# EAGLE design stm32f4-discovery_microhal (EAGLE 7.3.0)
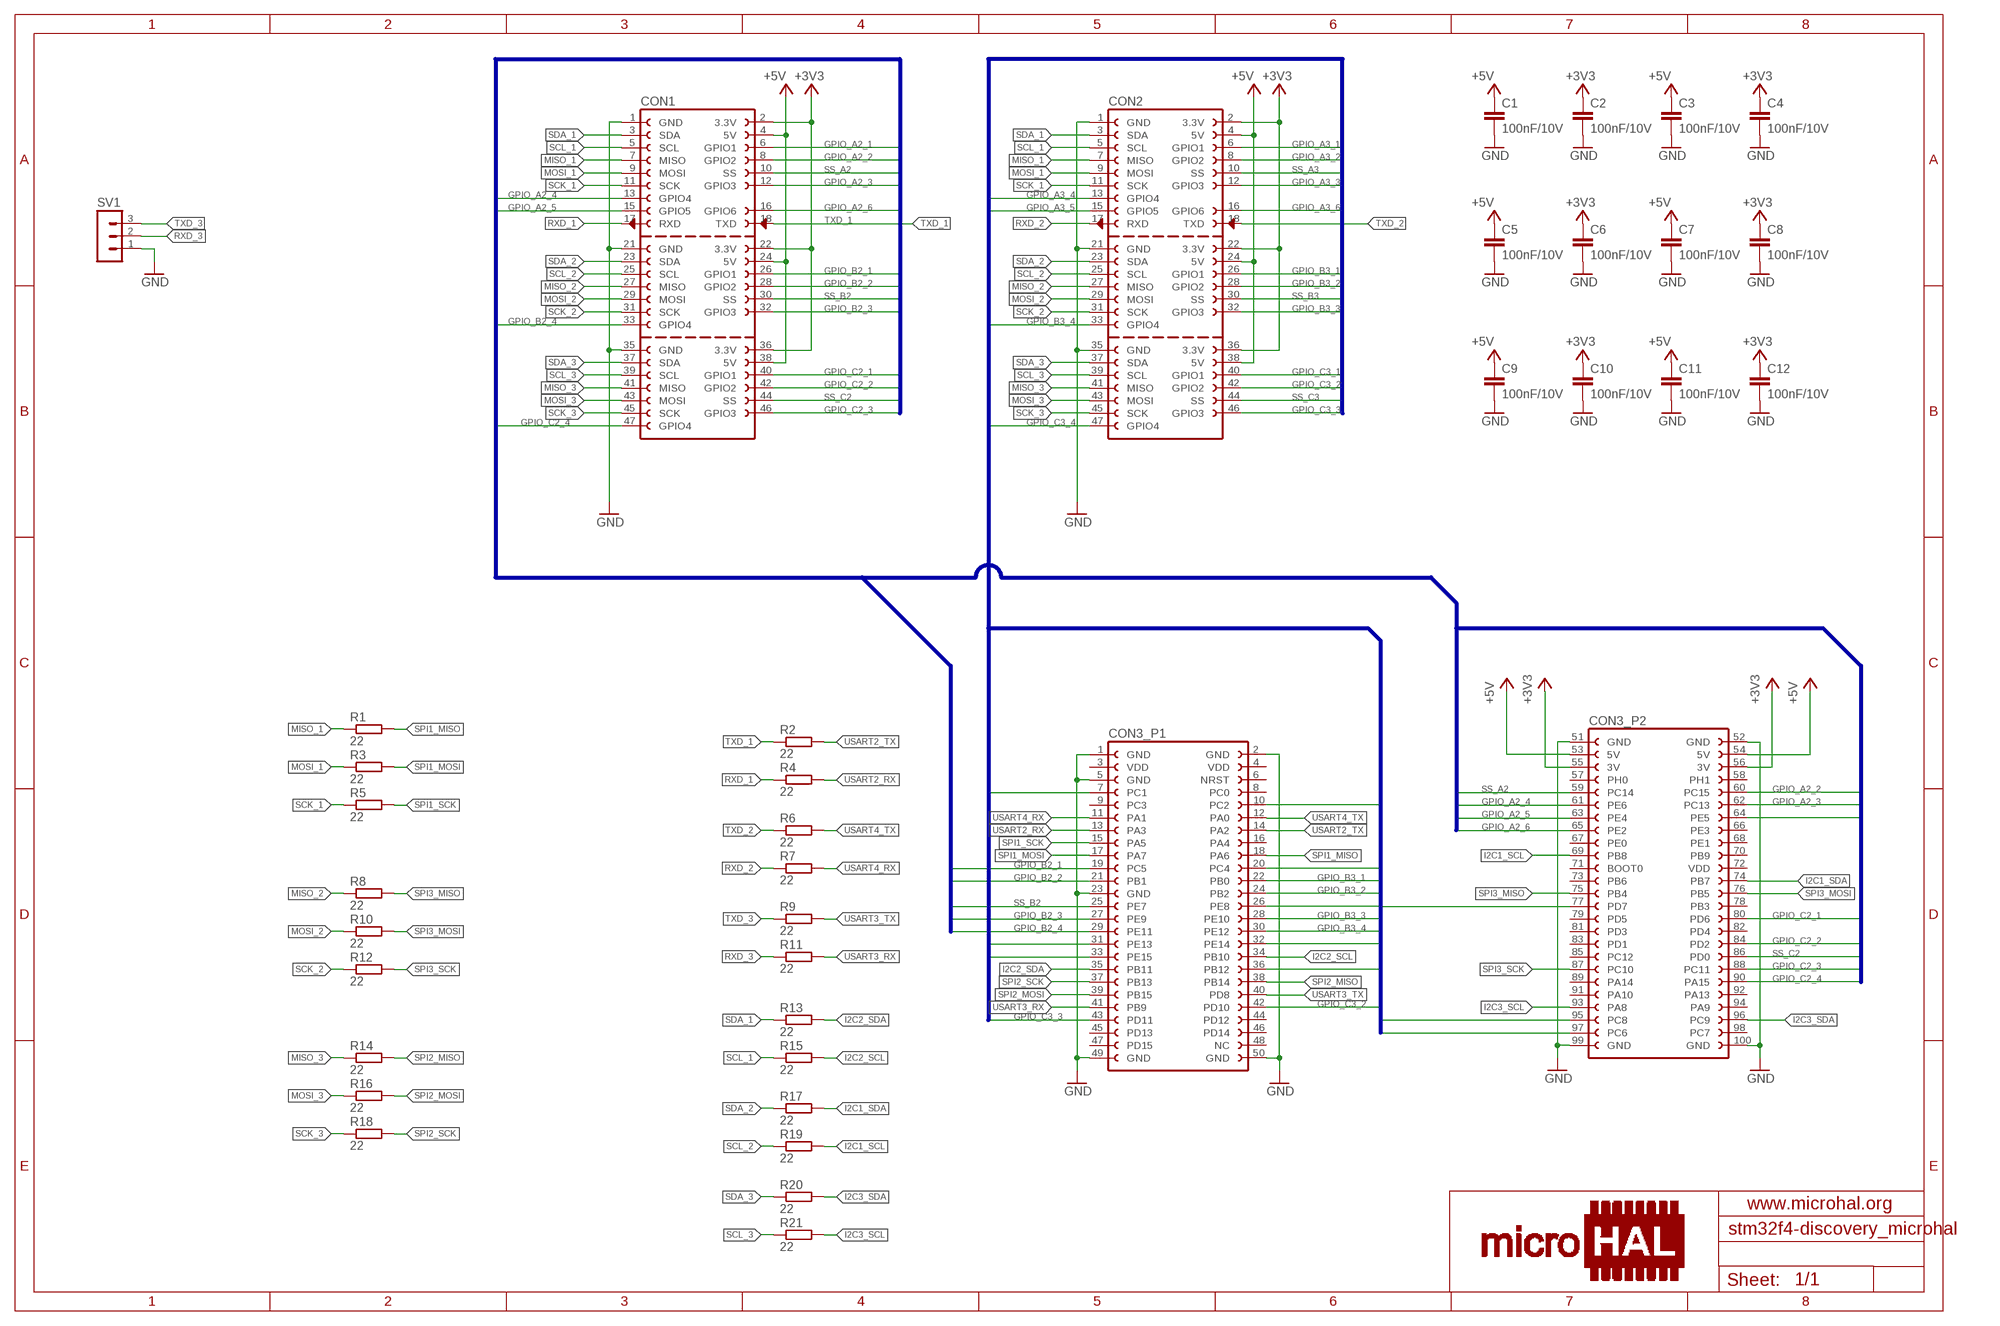
[diagram p0: schematic, sheet 1]

## Parts
C1  100nF/10V  C-EUC0603K  [C0603K]
C2  100nF/10V  C-EUC0603K  [C0603K]
C3  100nF/10V  C-EUC0603K  [C0603K]
C4  100nF/10V  C-EUC0603K  [C0603K]
C5  100nF/10V  C-EUC0603K  [C0603K]
C6  100nF/10V  C-EUC0603K  [C0603K]
C7  100nF/10V  C-EUC0603K  [C0603K]
C8  100nF/10V  C-EUC0603K  [C0603K]
C9  100nF/10V  C-EUC0603K  [C0603K]
C10  100nF/10V  C-EUC0603K  [C0603K]
C11  100nF/10V  C-EUC0603K  [C0603K]
C12  100nF/10V  C-EUC0603K  [C0603K]
CON1  MICROHAL_CONNECTOR_F_3  [MICROHAL_CONNECTOR_F_3]
CON2  MICROHAL_CONNECTOR_F_3  [MICROHAL_CONNECTOR_F_3]
CON3  STM32F4DISCOVERY-CONNECTOR  [STM32F4DISCOVERY_CONNECTOR]
R1  22  R-EU_R0603  [R0603]
R2  22  R-EU_R0603  [R0603]
R3  22  R-EU_R0603  [R0603]
R4  22  R-EU_R0603  [R0603]
R5  22  R-EU_R0603  [R0603]
R6  22  R-EU_R0603  [R0603]
R7  22  R-EU_R0603  [R0603]
R8  22  R-EU_R0603  [R0603]
R9  22  R-EU_R0603  [R0603]
R10  22  R-EU_R0603  [R0603]
R11  22  R-EU_R0603  [R0603]
R12  22  R-EU_R0603  [R0603]
R13  22  R-EU_R0603  [R0603]
R14  22  R-EU_R0603  [R0603]
R15  22  R-EU_R0603  [R0603]
R16  22  R-EU_R0603  [R0603]
R17  22  R-EU_R0603  [R0603]
R18  22  R-EU_R0603  [R0603]
R19  22  R-EU_R0603  [R0603]
R20  22  R-EU_R0603  [R0603]
R21  22  R-EU_R0603  [R0603]
SV1  MA03-1  [MA03-1]

## Nets
+3V3: C2.1 C4.1 C6.1 C8.1 C10.1 C12.1 CON1.2(3.3V) CON1.22(3.3V) CON1.36(3.3V) CON2.2(3.3V) CON2.22(3.3V) CON2.36(3.3V) CON3.55(_P2:3V) CON3.56(_P2:3V)
+5V: C1.1 C3.1 C5.1 C7.1 C9.1 C11.1 CON1.4(5V) CON1.24(5V) CON1.38(5V) CON2.4(5V) CON2.24(5V) CON2.38(5V) CON3.53(_P2:5V) CON3.54(_P2:5V)
GND: C1.2 C2.2 C3.2 C4.2 C5.2 C6.2 C7.2 C8.2 C9.2 C10.2 C11.2 C12.2 CON1.1(GND) CON1.21(GND) CON1.35(GND) CON2.1(GND) CON2.21(GND) CON2.35(GND) CON3.1(_P1:GND) CON3.2(_P1:GND) CON3.5(_P1:GND) CON3.23(_P1:GND) CON3.49(_P1:GND) CON3.50(_P1:GND) CON3.51(_P2:GND) CON3.52(_P2:GND) CON3.99(_P2:GND) CON3.100(_P2:GND) SV1.1
GPIO_A2_1: CON1.6(GPIO1) CON3.64(_P2:PE5)
GPIO_A2_2: CON1.8(GPIO2) CON3.60(_P2:PC15)
GPIO_A2_3: CON1.12(GPIO3) CON3.62(_P2:PC13)
GPIO_A2_4: CON1.13(GPIO4) CON3.61(_P2:PE6)
GPIO_A2_5: CON1.15(GPIO5) CON3.63(_P2:PE4)
GPIO_A2_6: CON1.16(GPIO6) CON3.65(_P2:PE2)
GPIO_A3_1: CON2.6(GPIO1) CON3.97(_P2:PC6)
GPIO_A3_2: CON2.8(GPIO2) CON3.31(_P1:PE13)
GPIO_A3_3: CON2.12(GPIO3) CON3.7(_P1:PC1)
GPIO_A3_4: CON2.13(GPIO4) CON3.10(_P1:PC2)
GPIO_A3_5: CON2.15(GPIO5) CON3.20(_P1:PC4)
GPIO_A3_6: CON2.16(GPIO6) CON3.77(_P2:PD7)
GPIO_B2_1: CON1.26(GPIO1) CON3.19(_P1:PC5)
GPIO_B2_2: CON1.28(GPIO2) CON3.21(_P1:PB1)
GPIO_B2_3: CON1.32(GPIO3) CON3.27(_P1:PE9)
GPIO_B2_4: CON1.33(GPIO4) CON3.29(_P1:PE11)
GPIO_B3_1: CON2.26(GPIO1) CON3.22(_P1:PB0)
GPIO_B3_2: CON2.28(GPIO2) CON3.24(_P1:PB2)
GPIO_B3_3: CON2.32(GPIO3) CON3.28(_P1:PE10)
GPIO_B3_4: CON2.33(GPIO4) CON3.30(_P1:PE12)
GPIO_C2_1: CON1.40(GPIO1) CON3.80(_P2:PD6)
GPIO_C2_2: CON1.42(GPIO2) CON3.84(_P2:PD2)
GPIO_C2_3: CON1.46(GPIO3) CON3.88(_P2:PC11)
GPIO_C2_4: CON1.47(GPIO4) CON3.90(_P2:PA15)
GPIO_C3_1: CON2.40(GPIO1) CON3.32(_P1:PE14)
GPIO_C3_2: CON2.42(GPIO2) CON3.42(_P1:PD10)
GPIO_C3_3: CON2.46(GPIO3) CON3.43(_P1:PD11)
GPIO_C3_4: CON2.47(GPIO4) CON3.95(_P2:PC8)
I2C1_SCL: CON3.69(_P2:PB8) R19.2
I2C1_SDA: CON3.74(_P2:PB7) R17.2
I2C2_SCL: CON3.34(_P1:PB10) R15.2
I2C2_SDA: CON3.35(_P1:PB11) R13.2
I2C3_SCL: CON3.93(_P2:PA8) R21.2
I2C3_SDA: CON3.96(_P2:PC9) R20.2
MISO_1: CON1.7(MISO) CON2.7(MISO) R1.1
MISO_2: CON1.27(MISO) CON2.27(MISO) R8.1
MISO_3: CON1.41(MISO) CON2.41(MISO) R14.1
MOSI_1: CON1.9(MOSI) CON2.9(MOSI) R3.1
MOSI_2: CON1.29(MOSI) CON2.29(MOSI) R10.1
MOSI_3: CON1.43(MOSI) CON2.43(MOSI) R16.1
RXD_1: CON1.17(RXD) R4.1
RXD_2: CON2.17(RXD) R7.1
RXD_3: R11.1 SV1.2
SCK_1: CON1.11(SCK) CON2.11(SCK) R5.1
SCK_2: CON1.31(SCK) CON2.31(SCK) R12.1
SCK_3: CON1.45(SCK) CON2.45(SCK) R18.1
SCL_1: CON1.5(SCL) CON2.5(SCL) R15.1
SCL_2: CON1.25(SCL) CON2.25(SCL) R19.1
SCL_3: CON1.39(SCL) CON2.39(SCL) R21.1
SDA_1: CON1.3(SDA) CON2.3(SDA) R13.1
SDA_2: CON1.23(SDA) CON2.23(SDA) R17.1
SDA_3: CON1.37(SDA) CON2.37(SDA) R20.1
SPI1_MISO: CON3.18(_P1:PA6) R1.2
SPI1_MOSI: CON3.17(_P1:PA7) R3.2
SPI1_SCK: CON3.15(_P1:PA5) R5.2
SPI2_MISO: CON3.38(_P1:PB14) R14.2
SPI2_MOSI: CON3.39(_P1:PB15) R16.2
SPI2_SCK: CON3.37(_P1:PB13) R18.2
SPI3_MISO: CON3.75(_P2:PB4) R8.2
SPI3_MOSI: CON3.76(_P2:PB5) R10.2
SPI3_SCK: CON3.87(_P2:PC10) R12.2
SS_A2: CON1.10(SS) CON3.59(_P2:PC14)
SS_A3: CON2.10(SS) CON3.33(_P1:PE15)
SS_B2: CON1.30(SS) CON3.25(_P1:PE7)
SS_B3: CON2.30(SS) CON3.26(_P1:PE8)
SS_C2: CON1.44(SS) CON3.86(_P2:PD0)
SS_C3: CON2.44(SS) CON3.36(_P1:PB12)
TXD_1: CON1.18(TXD) R2.1
TXD_2: CON2.18(TXD) R6.1
TXD_3: R9.1 SV1.3
USART2_RX: CON3.13(_P1:PA3) R4.2
USART2_TX: CON3.14(_P1:PA2) R2.2
USART3_RX: CON3.41(_P1:PB9) R11.2
USART3_TX: CON3.40(_P1:PD8) R9.2
USART4_RX: CON3.11(_P1:PA1) R7.2
USART4_TX: CON3.12(_P1:PA0) R6.2
Unconnected: CON3.3(_P1:VDD) CON3.4(_P1:VDD) CON3.6(_P1:NRST) CON3.8(_P1:PC0) CON3.9(_P1:PC3) CON3.16(_P1:PA4) CON3.44(_P1:PD12) CON3.45(_P1:PD13) CON3.46(_P1:PD14) CON3.47(_P1:PD15) CON3.48(_P1:NC) CON3.57(_P2:PH0) CON3.58(_P2:PH1) CON3.66(_P2:PE3) CON3.67(_P2:PE0) CON3.68(_P2:PE1) CON3.70(_P2:PB9) CON3.71(_P2:BOOT0) CON3.72(_P2:VDD) CON3.73(_P2:PB6) CON3.78(_P2:PB3) CON3.79(_P2:PD5) CON3.81(_P2:PD3) CON3.82(_P2:PD4) CON3.83(_P2:PD1) CON3.85(_P2:PC12) CON3.89(_P2:PA14) CON3.91(_P2:PA10) CON3.92(_P2:PA13) CON3.94(_P2:PA9) CON3.98(_P2:PC7)

## Buses
GPIO_A2_[1..6],GPIO_B2_[1..4],GPIO_C2_[1..4],SS_A2,SS_B2,SS_C2
GPIO_A3_[1..6],GPIO_B3_[1..4],GPIO_C3_[1..4],SS_A3,SS_B3,SS_C3

## Library data of the parts
C1-C12 = rcl:C-EU: CAPACITOR, European symbol
CON1 CON2 = microhal-connector_v0.1:MICROHAL_CONNECTOR_F_3: Connector used in microhal development board.
CON3 = stm32f4Discovery_connector:STM32F4DISCOVERY-CONNECTOR
R1-R21 = rcl:R-EU_: RESISTOR, European symbol
SV1 = con-lstb:MA03-1: PIN HEADER; OC_FARNELL: unknown; OC_NEWARK: unknown

## Board
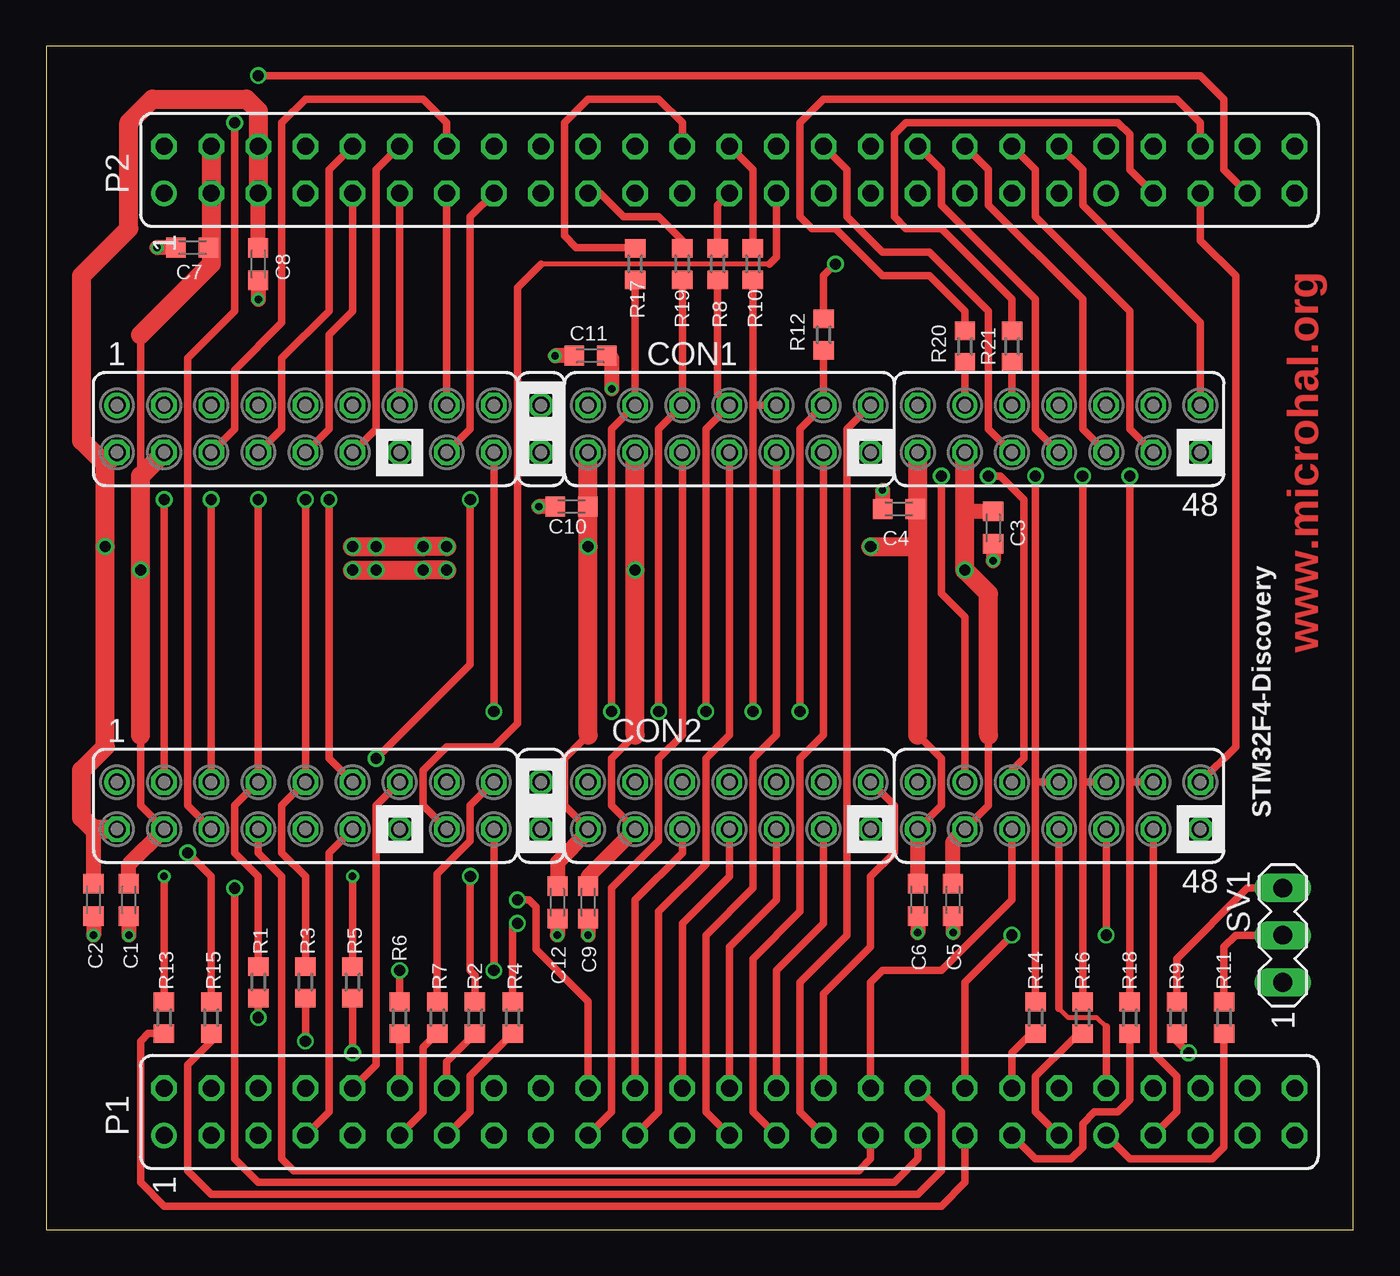
[diagram p1: board, top side]
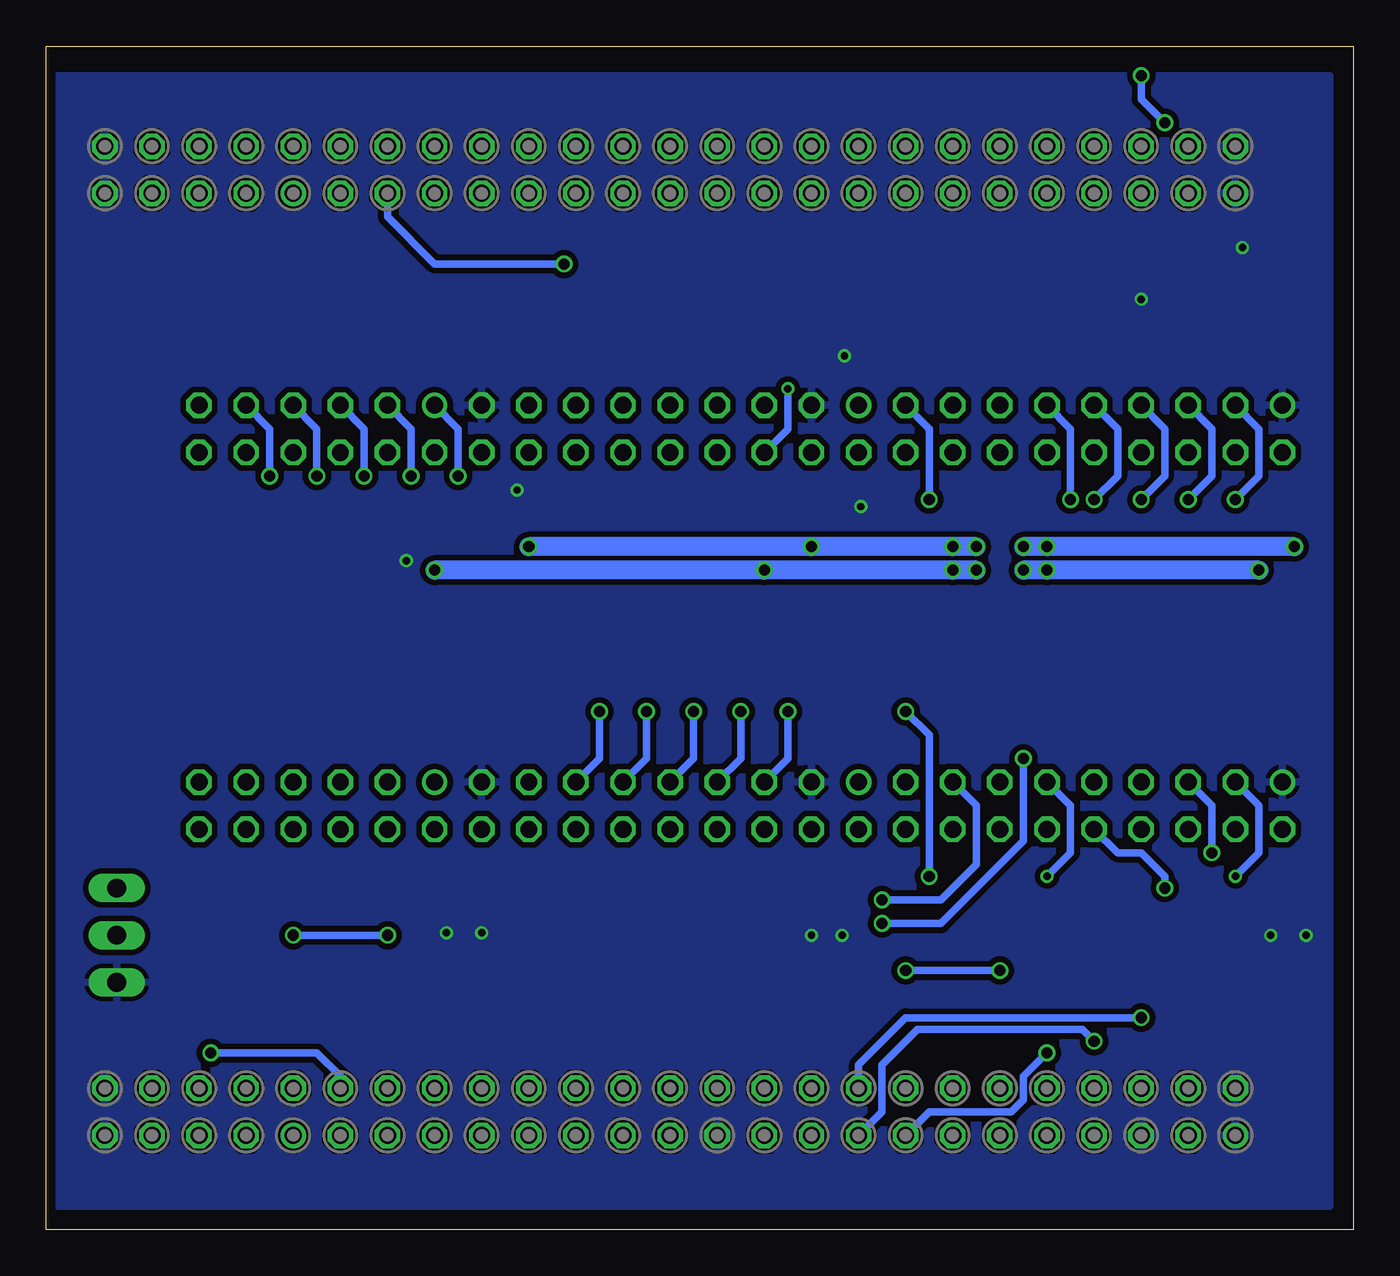
[diagram p2: board, bottom side, seen from below]

Size 70.47 x 63.8 mm. Coordinates in mm from the lower left corner, seen from the top.
Outline: 0,0 70.47,0 70.47,63.8 0,63.8 0,0
Copper layers (1*16): Top 0.035mm / dielectric 1.6mm / Bottom 0.035mm
Design rules "Elecrow_2-layer_PCB_eagle_rule": minimum track width 6mil, minimum drill 12mil, track to track 6mil, track to pad 6mil, pad to pad 6mil, via to via 8mil, smd to smd 0mil, copper to edge 20mil, drill to drill 10mil, minimum pad ring 6mil, minimum via ring 6mil, stop-mask expansion 0mil, vias tented up to drill 100mil, thermal gap 10mil

### Footprints (pad centres in the part's own frame; a part is rotated, then mirrored left to right if it is on the bottom)
C0603K = smd 1.05 x 1.08: 1 -0.875,0; 2 0.875,0
MICROHAL_CONNECTOR_F_3 = drill 0.914: 1 -33.02,1.27; 19 -10.16,1.27; 37 12.7,1.27 | drill 0.914 octagon: 2 -33.02,-1.27; 3 -30.48,1.27; 4 -30.48,-1.27; 5 -27.94,1.27; 6 -27.94,-1.27; 7 -25.4,1.27; 8 -25.4,-1.27; 9 -22.86,1.27; 10 -22.86,-1.27; 11 -20.32,1.27; 12 -20.32,-1.27; 13 -17.78,1.27; 14 -17.78,-1.27; 15 -15.24,1.27; 16 -15.24,-1.27; 17 -12.7,1.27; 18 -12.7,-1.27; 20 -10.16,-1.27; 21 -7.62,1.27; 22 -7.62,-1.27; 23 -5.08,1.27; 24 -5.08,-1.27; 25 -2.54,1.27; 26 -2.54,-1.27; 27 0,1.27; 28 0,-1.27; 29 2.54,1.27; 30 2.54,-1.27; 31 5.08,1.27; 32 5.08,-1.27; 33 7.62,1.27; 34 7.62,-1.27; 35 10.16,1.27; 36 10.16,-1.27; 38 12.7,-1.27; 39 15.24,1.27; 40 15.24,-1.27; 41 17.78,1.27; 42 17.78,-1.27; 43 20.32,1.27; 44 20.32,-1.27; 45 22.86,1.27; 46 22.86,-1.27; 47 25.4,1.27; 48 25.4,-1.27
STM32F4DISCOVERY_CONNECTOR = drill 0.914: 1 -1.27,30.48; 41 -1.27,-20.32; 51 49.53,30.48; 91 49.53,-20.32 | drill 0.914 octagon: 2 1.27,30.48; 3 -1.27,27.94; 4 1.27,27.94; 5 -1.27,25.4; 6 1.27,25.4; 7 -1.27,22.86; 8 1.27,22.86; 9 -1.27,20.32; 10 1.27,20.32; 11 -1.27,17.78; 12 1.27,17.78; 13 -1.27,15.24; 14 1.27,15.24; 15 -1.27,12.7; 16 1.27,12.7; 17 -1.27,10.16; 18 1.27,10.16; 19 -1.27,7.62; 20 1.27,7.62; 21 -1.27,5.08; 22 1.27,5.08; 23 -1.27,2.54; 24 1.27,2.54; 25 -1.27,0; 26 1.27,0; 27 -1.27,-2.54; 28 1.27,-2.54; 29 -1.27,-5.08; 30 1.27,-5.08; 31 -1.27,-7.62; 32 1.27,-7.62; 33 -1.27,-10.16; 34 1.27,-10.16; 35 -1.27,-12.7; 36 1.27,-12.7; 37 -1.27,-15.24; 38 1.27,-15.24; 39 -1.27,-17.78; 40 1.27,-17.78; 42 1.27,-20.32; 43 -1.27,-22.86; 44 1.27,-22.86; 45 -1.27,-25.4; 46 1.27,-25.4; 47 -1.27,-27.94; 48 1.27,-27.94; 49 -1.27,-30.48; 50 1.27,-30.48; 52 52.07,30.48; 53 49.53,27.94; 54 52.07,27.94; 55 49.53,25.4; 56 52.07,25.4; 57 49.53,22.86; 58 52.07,22.86; 59 49.53,20.32; 60 52.07,20.32; 61 49.53,17.78; 62 52.07,17.78; 63 49.53,15.24; 64 52.07,15.24; 65 49.53,12.7; 66 52.07,12.7; 67 49.53,10.16; 68 52.07,10.16; 69 49.53,7.62; 70 52.07,7.62; 71 49.53,5.08; 72 52.07,5.08; 73 49.53,2.54; 74 52.07,2.54; 75 49.53,0; 76 52.07,0; 77 49.53,-2.54; 78 52.07,-2.54; 79 49.53,-5.08; 80 52.07,-5.08; 81 49.53,-7.62; 82 52.07,-7.62; 83 49.53,-10.16; 84 52.07,-10.16; 85 49.53,-12.7; 86 52.07,-12.7; 87 49.53,-15.24; 88 52.07,-15.24; 89 49.53,-17.78; 90 52.07,-17.78; 92 52.07,-20.32; 93 49.53,-22.86; 94 52.07,-22.86; 95 49.53,-25.4; 96 52.07,-25.4; 97 49.53,-27.94; 98 52.07,-27.94; 99 49.53,-30.48; 100 52.07,-30.48
R0603 = smd 1 x 1.1: 1 -0.85,0; 2 0.85,0
MA03-1 = drill 1.016 long: 1 -2.54,0; 2 0,0; 3 2.54,0

### Placement (x,y rotation side)
C1  4.45,17.78 270 top
C2  2.54,17.78 270 top
C3  51.05,37.85 270 top
C4  45.97,38.86 180 top
C5  48.9,17.78 270 top
C6  46.99,17.78 270 top
C7  7.87,52.96 180 top
C8  11.43,52.07 270 top
C9  29.21,17.65 270 top
C10  28.32,38.99 180 top
C11  29.34,47.12 180 top
C12  27.56,17.65 270 top
CON1  36.83,43.18 0 top
CON2  36.83,22.86 0 top
CON3  36.83,6.35 90 top
R1  11.43,13.34 270 top
R2  23.11,11.43 270 top
R3  13.97,13.34 270 top
R4  25.15,11.43 270 top
R5  16.51,13.34 270 top
R6  19.05,11.43 270 top
R7  21.08,11.43 270 top
R8  36.2,52.07 90 top
R9  60.96,11.43 270 top
R10  38.1,52.07 90 top
R11  63.5,11.43 270 top
R12  41.91,48.26 90 top
R13  6.35,11.43 270 top
R14  53.34,11.43 270 top
R15  8.89,11.43 270 top
R16  55.88,11.43 270 top
R17  31.75,52.07 90 top
R18  58.42,11.43 270 top
R19  34.29,52.07 90 top
R20  49.53,47.62 90 top
R21  52.07,47.62 90 top
SV1  66.67,15.88 90 top

### Tracks (layer width: path | path; a pad name or v marks a point on that pad's centre or on a via)
+3V3  (via drill 0.6)
  Top 0.406: CON2.36 48.26,22.86 48.26,25.4 46.99,26.67 | CON2.22 27.94,22.86 27.94,25.4 29.21,26.67
  Top 0.813: C2.1 2.54,21.59 | C4.1 46.86,38.86 46.99,38.73 | C6.1 CON2.36 | C8.1 CON3.55 | C10.1 29.2,39.36 29.21,39.37 | CON2.22 29.21,21.46 27.56,19.81 C12.1
  Top 1.016: CON2.2 2.54,21.59 1.91,22.23 1.91,24.77 3.17,26.04 v3.17,36.83 3.17,41.27 | 3.17,41.27 CON1.2 | 46.99,26.67 46.99,36.83 | 46.99,36.83 46.99,38.73 CON1.36 | 29.21,26.67 v29.21,36.83 29.21,39.37 CON1.22 | v44.45,36.83 46.99,36.83 | v16.51,36.83 v17.78,36.83 v20.32,36.83 v21.59,36.83 | CON3.55 CON3.56 11.43,60.33 10.79,60.96 5.71,60.96 4.45,59.69 4.45,53.98 1.91,51.44 1.91,42.55 3.17,41.27
  Bottom 1.016: v3.17,36.83 v16.51,36.83 v17.78,36.83 | v20.32,36.83 v21.59,36.83 v29.21,36.83 v44.45,36.83
+5V  (via drill 0.4, 0.6)
  Top 0.406: CON2.4 5.08,22.86 5.08,26.67 | CON2.38 50.8,22.86 50.8,26.67 | CON2.24 30.48,22.86 30.48,25.4 31.75,26.67 | 5.08,48.26 5.08,40.64
  Top 0.813: C1.1 4.45,19.68 CON2.4 | C3.1 49.54,38.72 49.53,38.73 | C5.1 48.9,20.95 CON2.38 | C7.1 8.75,53.2 8.89,53.34 | CON2.24 29.21,19.05 C9.1 | C11.1 30.35,47.12 30.48,46.99 v30.48,45.34
  Top 1.016: 5.08,26.67 v5.08,35.56 5.08,40.64 CON1.4 | 50.8,26.67 50.8,34.29 v49.53,35.56 49.53,38.73 CON1.38 | 31.75,26.67 v31.75,35.56 CON1.24 | CON3.54 CON3.53 8.89,53.34 8.89,52.07 5.08,48.26 | v21.59,35.56 v20.32,35.56 v17.78,35.56 v16.51,35.56
  Bottom 0.406: v30.48,45.34 30.48,43.18 CON1.24
  Bottom 1.016: v5.08,35.56 v16.51,35.56 v17.78,35.56 | v20.32,35.56 v21.59,35.56 v31.75,35.56 v49.53,35.56
GND  (via drill 0.4)
  Top 0.813: C2.2 v2.54,15.88 | C1.2 v4.45,15.88 | C4.2 45.1,39.86 v45.09,39.88 | C3.2 v51.05,36.07 | C6.2 v46.99,16 | C5.2 v48.9,16 | C7.2 v5.97,52.96 | C8.2 v11.43,50.16 | C9.2 v29.21,15.88 | C10.2 v26.54,38.99 | C12.2 v27.56,15.88 | C11.2 v27.43,47.12
  pour Bottom (isolate 0.305): 1.27,62.23 69.85,62.23 69.85,1.27 1.27,1.27
GPIO_A2_1
  Top 0.406: CON1.6 10.16,43.18 10.16,46.35 12.7,48.9 12.7,59.69 13.97,60.96 20.32,60.96 21.59,59.69 CON3.64
GPIO_A2_2
  Top 0.406: CON3.60 15.24,57.15 15.24,49.53 12.7,46.99 12.7,43.18 CON1.8
GPIO_A2_3
  Top 0.406: CON3.62 17.78,57.15 17.78,43.18 CON1.12
GPIO_A2_4
  Top 0.406: CON1.13 CON3.61
GPIO_A2_5
  Top 0.406: CON1.15 CON3.63
GPIO_A2_6
  Top 0.406: CON3.65 22.86,54.61 22.86,43.18 CON1.16
GPIO_A3_1  (via drill 0.6)
  Top 0.406: CON3.97 63.5,57.15 63.5,60.96 62.23,62.23 v11.43,62.23 | v10.16,59.69 10.16,49.53 7.62,46.99 7.62,22.86 CON2.6
  Bottom 0.406: v11.43,62.23 11.43,60.96 v10.16,59.69
GPIO_A3_2
  Top 0.406: CON2.8 11.43,20.32 12.7,19.05 12.7,3.81 13.34,3.17 43.81,3.17 44.45,3.81 CON3.31
GPIO_A3_3
  Top 0.406: CON3.7 15.24,6.35 15.24,20.32 CON2.12
GPIO_A3_4
  Top 0.406: CON3.10 17.78,8.89 17.78,22.86 CON2.13
GPIO_A3_5  (via drill 0.6)
  Top 0.406: CON3.20 29.21,12.32 26.42,15.11 26.42,17.4 26.04,17.78 v25.4,17.78
  Bottom 0.406: CON2.15 20.32,22.86 20.32,19.68 22.23,17.78 v25.4,17.78
GPIO_A3_6
  Top 0.279: 38.99,52.07 26.67,52.07
  Top 0.406: CON3.77 39.37,52.45 38.99,52.07 | 26.67,52.07 25.4,50.8 25.4,27.3 24.13,26.04 21.59,26.04 20.32,24.77 20.32,22.86 CON2.16
GPIO_B2_1
  Top 0.406: CON3.19 30.48,6.35 30.48,18.41 33.02,20.95 33.02,25.4 34.29,26.67 CON1.26
GPIO_B2_2
  Top 0.406: CON3.21 33.02,6.35 33.02,17.14 35.56,19.68 35.56,25.4 36.83,26.67 CON1.28
GPIO_B2_3
  Top 0.406: CON3.27 38.1,6.35 38.1,14.61 40.64,17.14 40.64,25.4 41.91,26.67 CON1.32
GPIO_B2_4
  Top 0.406: CON3.29 40.64,6.35 40.64,13.34 43.18,15.88 43.18,43.18 CON1.33
GPIO_B3_1
  Top 0.406: CON3.22 31.75,17.78 34.29,20.32 CON2.26
GPIO_B3_2
  Top 0.406: CON3.24 34.29,16.51 36.83,19.05 CON2.28
GPIO_B3_3
  Top 0.406: CON2.32 41.91,16.51 39.37,13.97 CON3.28
GPIO_B3_4
  Top 0.406: CON3.30 41.91,12.7 44.45,15.24 44.45,19.05 45.72,20.32 45.72,22.86 CON2.33
GPIO_C2_1
  Top 0.406: CON3.80 43.18,57.15 43.18,54.61 45.09,52.7 47.62,52.7 50.8,49.53 50.8,43.18 CON1.40
GPIO_C2_2
  Top 0.406: CON3.84 48.26,57.15 48.26,55.24 53.34,50.16 53.34,43.18 CON1.42
GPIO_C2_3
  Top 0.406: CON3.88 53.34,57.15 53.34,54.61 58.42,49.53 58.42,43.18 CON1.46
GPIO_C2_4
  Top 0.406: CON3.90 55.88,57.15 55.88,55.24 62.23,48.9 CON1.47
GPIO_C3_1
  Top 0.406: CON3.32 44.45,13.34 45.09,13.97 48.26,13.97 52.07,17.78 CON2.40
GPIO_C3_2
  Top 0.254: 57.15,10.92 56.64,11.43 | 55.12,11.43 54.61,11.94
  Top 0.279: 56.64,11.43 55.12,11.43
  Top 0.406: CON3.42 57.15,10.92 | 54.61,11.94 CON2.42
GPIO_C3_3
  Top 0.406: CON2.46 59.69,9.53 60.96,8.26 60.96,6.35 CON3.43
GPIO_C3_4
  Top 0.406: CON3.95 62.23,53.34 64.14,51.44 64.14,26.04 CON2.47
I2C1_SCL
  Top 0.406: CON3.69 29.84,55.88 31.11,54.61 33.02,54.61 34.29,53.34 R19.2
I2C1_SDA
  Top 0.406: CON3.74 34.29,59.69 33.02,60.96 29.21,60.96 27.94,59.69 27.94,53.59 28.57,52.96 31.75,52.96 R17.2
I2C2_SCL
  Top 0.406: R15.2 8.89,10.16 7.62,8.89 7.62,3.17 8.89,1.91 46.99,1.91 48.26,3.17 48.26,6.35 CON3.34
I2C2_SDA
  Top 0.406: R13.2 5.5,10.58 5.08,10.16 5.08,2.54 6.35,1.27 48.26,1.27 49.53,2.54 CON3.35
I2C3_SCL
  Top 0.406: 52.07,48.26 R21.2 52.07,50.16 48.26,53.98 46.35,53.98 45.72,54.61 45.72,59.05 46.35,59.69 57.78,59.69 58.42,59.05 58.42,57.15 CON3.93
I2C3_SDA
  Top 0.406: CON3.96 62.23,59.69 60.96,60.96 41.91,60.96 40.64,59.69 40.64,54.61 41.27,53.98 42.55,53.98 45.09,51.44 47.62,51.44 49.53,49.53 R20.2
MISO_1  (via drill 0.6)
  Top 0.406: R1.1 11.43,19.05 10.16,20.32 10.16,22.86 CON2.7 v11.43,39.37
  Bottom 0.406: v11.43,39.37 10.16,40.64 10.16,43.18 CON1.7
MISO_2  (via drill 0.6)
  Top 0.406: R8.1 36.2,45.09 CON1.27 35.56,43.18 v35.56,27.94
  Bottom 0.406: v35.56,27.94 35.56,25.4 CON2.27
MISO_3  (via drill 0.6)
  Top 0.406: v53.34,40.64 53.34,24.13 | CON2.41 53.34,24.13 | 53.34,24.13 R14.1
  Bottom 0.406: CON1.41 53.34,43.18 v53.34,40.64
MOSI_1  (via drill 0.6)
  Top 0.406: R3.1 13.97,19.05 12.7,20.32 12.7,22.86 CON2.9 v13.97,39.37
  Bottom 0.406: CON1.9 12.7,43.18 12.7,40.64 v13.97,39.37
MOSI_2  (via drill 0.6)
  Top 0.406: R10.1 38.1,44.45 | CON1.29 38.1,44.45 | 38.1,44.45 v38.1,27.94
  Bottom 0.406: v38.1,27.94 38.1,25.4 CON2.29
MOSI_3  (via drill 0.6)
  Top 0.406: v55.88,40.64 55.88,24.13 | CON2.43 55.88,24.13 | 55.88,24.13 R16.1
  Bottom 0.406: CON1.43 55.88,43.18 v55.88,40.64
RXD_1  (via drill 0.6)
  Top 0.406: v22.86,39.37 22.86,30.48 v17.78,25.4 | R4.1 25.15,16.26 v25.4,16.51
  Bottom 0.406: CON1.17 22.86,43.18 v22.86,39.37 | v17.78,25.4 17.78,20.95 22.23,16.51 v25.4,16.51
RXD_2
  Top 0.406: CON2.17 22.86,22.86 22.86,20.95 21.08,19.18 R7.1
RXD_3
  Top 0.406: SV1.2 64.14,15.88 63.5,15.24 R11.1
SCK_1  (via drill 0.4, 0.6)
  Top 0.406: v15.24,39.37 15.24,25.4 CON2.11 | R5.1 v16.51,19.05
  Bottom 0.406: CON1.11 15.24,43.18 v15.24,39.37 | v16.51,19.05 15.24,20.32 15.24,22.86 CON2.11
SCK_2  (via drill 0.6)
  Top 0.406: R12.1 CON1.31 40.64,43.18 v40.64,27.94
  Bottom 0.406: v40.64,27.94 40.64,25.4 CON2.31
SCK_3  (via drill 0.6)
  Top 0.406: v58.42,40.64 58.42,24.13 | CON2.45 58.42,24.13 | 58.42,24.13 R18.1
  Bottom 0.406: CON1.45 58.42,43.18 v58.42,40.64
SCL_1  (via drill 0.6)
  Top 0.406: R15.1 8.89,19.05 v7.62,20.32 | CON2.5 v8.89,39.37
  Bottom 0.406: v7.62,20.32 7.62,22.86 CON2.5 | v8.89,39.37 7.62,40.64 7.62,43.18 CON1.5
SCL_2  (via drill 0.6)
  Top 0.406: R19.1 CON1.25 33.02,43.18 v33.02,27.94
  Bottom 0.406: v33.02,27.94 33.02,25.4 CON2.25
SCL_3  (via drill 0.6)
  Top 0.406: R21.1 CON1.39 | v50.8,40.64 51.44,40.64 52.7,39.37 52.7,25.4 52.07,24.77 CON2.39
  Bottom 0.406: CON1.39 50.8,43.18 v50.8,40.64
SDA_1  (via drill 0.4, 0.6)
  Top 0.406: v6.35,39.37 CON2.3 | R13.1 v6.35,19.05
  Bottom 0.406: CON1.3 5.08,43.18 5.08,40.64 v6.35,39.37 | v6.35,19.05 5.08,20.32 5.08,22.86 CON2.3
SDA_2  (via drill 0.6)
  Top 0.406: R17.1 CON1.23 30.48,43.18 v30.48,27.94
  Bottom 0.406: v30.48,27.94 30.48,25.4 CON2.23
SDA_3  (via drill 0.6)
  Top 0.406: R20.1 CON1.37 | v48.26,40.64 48.26,34.29 49.53,33.02 CON2.37
  Bottom 0.406: CON1.37 48.26,43.18 v48.26,40.64
SPI1_MISO  (via drill 0.6)
  Top 0.406: v11.43,11.43 R1.2
  Bottom 0.406: CON3.18 26.67,8.89 24.13,11.43 v11.43,11.43
SPI1_MOSI  (via drill 0.6)
  Top 0.406: v13.97,10.16 R3.2
  Bottom 0.406: CON3.17 25.4,6.35 25.4,8.89 23.5,10.79 14.61,10.79 v13.97,10.16
SPI1_SCK  (via drill 0.6)
  Top 0.406: R5.2 v16.51,9.53
  Bottom 0.406: CON3.15 22.86,6.35 18.41,6.35 17.78,6.99 17.78,8.26 v16.51,9.53
SPI2_MISO
  Top 0.406: CON3.38 52.07,9.53 53.34,10.79 R14.2
SPI2_MOSI
  Top 0.406: R16.2 55.88,10.79 55.24,10.16 53.34,8.26 53.34,6.35 CON3.39
SPI2_SCK
  Top 0.406: CON3.37 53.34,3.81 55.24,3.81 55.88,4.45 55.88,5.71 56.52,6.35 57.78,6.35 58.42,6.99 R18.2
SPI3_MISO
  Top 0.406: R8.2 36.2,55.24 CON3.75
SPI3_MOSI
  Top 0.406: CON3.76 38.1,57.15 R10.2
SPI3_SCK  (via drill 0.6)
  Top 0.406: R12.2 41.91,51.44 v42.55,52.07
  Bottom 0.406: v42.55,52.07 49.53,52.07 52.07,54.61 CON3.87
SS_A2
  Top 0.406: CON3.59 16.51,49.53 15.24,48.26 15.24,43.18 CON1.10
SS_A3  (via drill 0.6)
  Top 0.406: CON3.33 46.99,3.81 45.72,2.54 11.43,2.54 10.16,3.81 v10.16,18.41
  Bottom 0.406: CON2.10 12.7,20.32 11.43,20.32 10.16,19.05 v10.16,18.41
SS_B2
  Top 0.406: CON3.25 35.56,6.35 35.56,15.88 38.1,18.41 38.1,25.4 39.37,26.67 CON1.30
SS_B3
  Top 0.406: CON2.30 39.37,17.78 36.83,15.24 CON3.26
SS_C2
  Top 0.406: CON3.86 50.8,57.15 50.8,55.24 55.88,50.16 55.88,43.18 CON1.44
SS_C3  (via drill 0.6)
  Top 0.406: CON3.36 49.53,13.34 v52.07,15.88 | v57.15,15.88 CON2.44
  Bottom 0.406: v52.07,15.88 v57.15,15.88
TXD_1  (via drill 0.6)
  Top 0.406: CON1.18 v24.13,27.94 | R2.1 23.11,13.72 22.86,13.97 v22.86,19.05
  Bottom 0.406: v24.13,27.94 22.86,26.67 v22.86,19.05
TXD_2  (via drill 0.6)
  Top 0.406: CON2.18 v24.13,13.97 | v19.05,13.97 R6.1
  Bottom 0.406: v24.13,13.97 v19.05,13.97
TXD_3
  Top 0.406: SV1.3 64.77,18.41 60.96,14.61 R9.1
USART2_RX
  Top 0.406: CON3.13 22.86,6.35 22.86,8.29 R4.2
USART2_TX
  Top 0.406: CON3.14 21.59,9.06 R2.2
USART3_RX
  Top 0.406: CON3.41 58.42,3.81 62.87,3.81 63.5,4.45 R11.2
USART3_TX  (via drill 0.6)
  Top 0.406: R9.2 60.96,10.16 v61.59,9.53
  Bottom 0.406: v61.59,9.53 55.88,9.53 54.61,8.26 CON3.40
USART4_RX
  Top 0.406: CON3.11 20.32,6.35 20.32,9.82 R7.2
USART4_TX
  Top 0.406: CON3.12 R6.2

### Text on the board
Top: www.microhal.org
tPlace: STM32F4-Discovery
tStop: www.microhal.org